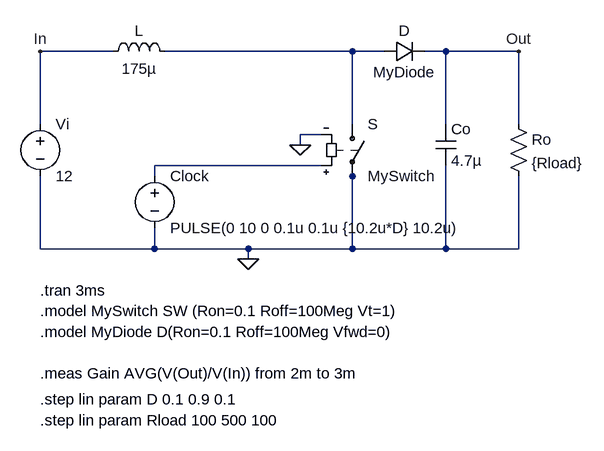
[diagram p0: schematic Boost Converter Ideale Guadagno DC.asc]
Boost Converter Ideale Guadagno DC.asc, the LTspice schematic file:
Version 4
SHEET 1 880 680
WIRE -272 -64 -384 -64
WIRE 96 -64 -192 -64
WIRE 144 -64 96 -64
WIRE 240 -64 208 -64
WIRE 352 -64 240 -64
WIRE -384 48 -384 -64
WIRE 96 48 96 -64
WIRE 240 48 240 -64
WIRE 352 48 352 -64
WIRE 48 64 16 64
WIRE 16 80 16 64
WIRE 48 112 -208 112
WIRE -208 128 -208 112
WIRE 96 128 96 112
WIRE -384 240 -384 128
WIRE -208 240 -208 208
WIRE -208 240 -384 240
WIRE -64 240 -208 240
WIRE 96 240 96 128
WIRE 96 240 -64 240
WIRE 240 240 240 112
WIRE 240 240 96 240
WIRE 352 240 352 128
WIRE 352 240 240 240
WIRE -64 256 -64 240
FLAG -64 256 0
FLAG 16 80 0
FLAG 352 -64 Out
FLAG -384 -64 In
SYMBOL ind -288 -48 R270
WINDOW 0 32 56 VTop 2
WINDOW 3 5 56 VBottom 2
SYMATTR InstName L
SYMATTR Value 175µ
SYMBOL cap 224 48 R0
SYMATTR InstName Co
SYMATTR Value 4.7µ
SYMBOL res 336 32 R0
SYMATTR InstName Ro
SYMATTR Value {Rload}
SYMBOL voltage -208 112 R0
WINDOW 123 0 0 Left 2
WINDOW 39 0 0 Left 2
SYMATTR InstName Clock
SYMATTR Value PULSE(0 10 0 0.1u 0.1u {10.2u*D} 10.2u)
SYMBOL voltage -384 32 R0
WINDOW 123 0 0 Left 2
WINDOW 39 0 0 Left 2
SYMATTR InstName Vi
SYMATTR Value 12
SYMBOL sw 96 32 R0
SYMATTR InstName S
SYMATTR Value MySwitch
SYMBOL diode 144 -48 R270
WINDOW 0 32 32 VTop 2
WINDOW 3 0 32 VBottom 2
SYMATTR InstName D
SYMATTR Value MyDiode
TEXT -384 304 Left 2 !.tran 3ms
TEXT -384 336 Left 2 !.model MySwitch SW (Ron=0.1 Roff=100Meg Vt=1)
TEXT -384 368 Left 2 !.model MyDiode D(Ron=0.1 Roff=100Meg Vfwd=0)
TEXT -384 432 Left 2 !.meas Gain AVG(V(Out)/V(In)) from 2m to 3m
TEXT -384 472 Left 2 !.step lin param D 0.1 0.9 0.1
TEXT -384 504 Left 2 !.step lin param Rload 100 500 100

The netlist it stands for:
* Boost Converter Ideale Guadagno DC.asc
L In N001 175µ
Co Out 0 4.7µ
Ro Out 0 {Rload}
V§Clock N002 0 PULSE(0 10 0 0.1u 0.1u {10.2u*D} 10.2u)
Vi In 0 12
S N001 0 N002 0 MySwitch
D N001 Out MyDiode
.model D D
.lib standard.dio
.tran 3ms
.model MySwitch SW (Ron=0.1 Roff=100Meg Vt=1)
.model MyDiode D(Ron=0.1 Roff=100Meg Vfwd=0)
.meas Gain AVG(V(Out)/V(In)) from 2m to 3m
.step lin param D 0.1 0.9 0.1
.step lin param Rload 100 500 100
.backanno
.end